# EAGLE design Teensy-Maxuino-Slave-DRV4835 4x shield v3 (EAGLE 6.4)
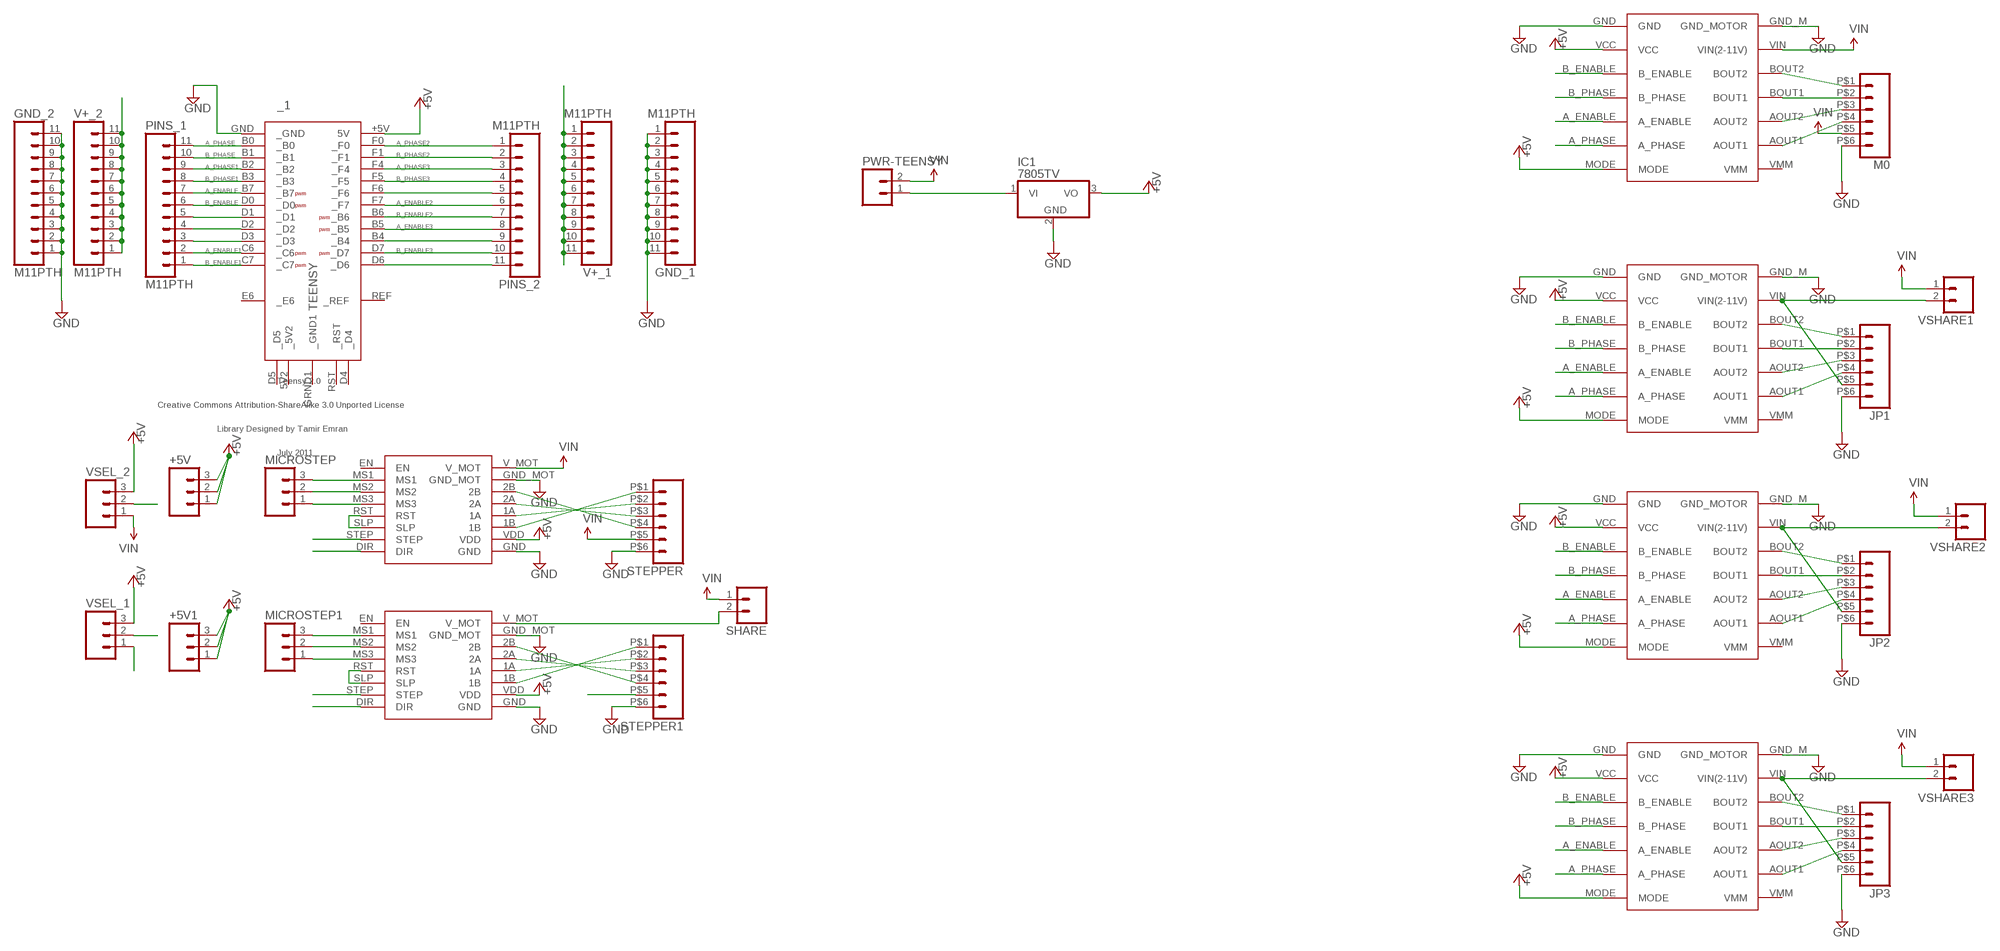
[diagram p0: schematic, sheet 1]

## Parts
+5V  M03PTH  [1X03]
+5V1  M03PTH  [1X03]
_1  TEENSY  [TEENSY]
A4988_1  POLOLU_A4988  [POLOLU_A4988]
A4988_2  POLOLU_A4988  [POLOLU_A4988]
DRV0  POLOLU_DRV8835  [POLOLU_DRV8835]
DRV1  POLOLU_DRV8835  [POLOLU_DRV8835]
DRV2  POLOLU_DRV8835  [POLOLU_DRV8835]
DRV3  POLOLU_DRV8835  [POLOLU_DRV8835]
GND_1  M11PTH  [1X11]
GND_2  M11PTH  [1X11]
IC1  7805TV  [TO220V]
JP1  M06  [SPRINGTERMINAL-2.54MM-6]
JP2  M06  [SPRINGTERMINAL-2.54MM-6]
JP3  M06  [SPRINGTERMINAL-2.54MM-6]
M0  M06  [SPRINGTERMINAL-2.54MM-6]
MICROSTEP  M03PTH  [1X03]
MICROSTEP1  M03PTH  [1X03]
PINS_1  M11PTH  [1X11]
PINS_2  M11PTH  [1X11]
PWR-TEENSY  M02PTH  [1X02]
SHARE  M02PTH  [1X02]
STEPPER  M06  [SPRINGTERMINAL-2.54MM-6]
STEPPER1  M06  [SPRINGTERMINAL-2.54MM-6]
V+_1  M11PTH  [1X11]
V+_2  M11PTH  [1X11]
VSEL_1  M03PTH  [1X03]
VSEL_2  M03PTH  [1X03]
VSHARE1  M02PTH  [1X02]
VSHARE2  M02PTH  [1X02]
VSHARE3  M02PTH  [1X02]

## Nets
+5V: +5V1.1 +5V1.2 +5V1.3 +5V.1 +5V.2 +5V.3 _1.+5V(5V) A4988_1.VDD A4988_2.VDD DRV0.MODE DRV0.VCC DRV1.MODE DRV1.VCC DRV2.MODE DRV2.VCC DRV3.MODE DRV3.VCC IC1.3(VO) VSEL_1.3 VSEL_2.3
A_ENABLE: _1.B7(_B7) DRV0.A_ENABLE PINS_1.7
A_ENABLE1: _1.C6(_C6) DRV1.A_ENABLE PINS_1.2
A_ENABLE2: _1.F7(_F7) DRV2.A_ENABLE PINS_2.6
A_ENABLE3: _1.B5(_B5) DRV3.A_ENABLE PINS_2.8
A_PHASE: _1.B0(_B0) DRV0.A_PHASE PINS_1.11
A_PHASE1: _1.B2(_B2) DRV1.A_PHASE PINS_1.9
A_PHASE2: _1.F0(_F0) DRV2.A_PHASE PINS_2.1
A_PHASE3: _1.F4(_F4) DRV3.A_PHASE PINS_2.3
ATTRU [GND]: JP1.P$6 JP2.P$6 JP3.P$6 M0.P$6 ; supply symbol labelled GND
B_ENABLE: _1.D0(_D0) DRV0.B_ENABLE PINS_1.6
B_ENABLE1: _1.C7(_C7) DRV1.B_ENABLE PINS_1.1
B_ENABLE2: _1.B6(_B6) DRV2.B_ENABLE PINS_2.7
B_ENABLE3: _1.D7(_D7) DRV3.B_ENABLE PINS_2.10
B_PHASE: _1.B1(_B1) DRV0.B_PHASE PINS_1.10
B_PHASE1: _1.B3(_B3) _1.D2(_D2) DRV1.B_PHASE PINS_1.4 PINS_1.8
B_PHASE2: _1.F1(_F1) DRV2.B_PHASE PINS_2.2
B_PHASE3: _1.F5(_F5) DRV3.B_PHASE PINS_2.4
DIR: _1.D6(_D6) A4988_1.DIR PINS_2.11
DIR1: _1.D1(_D1) A4988_2.DIR PINS_1.5
GND [GND]: _1.GND(_GND) A4988_1.GND A4988_1.GND_MOT A4988_2.GND A4988_2.GND_MOT DRV0.GND DRV0.GND_M(GND_MOTOR) DRV1.GND DRV1.GND_M(GND_MOTOR) DRV2.GND DRV2.GND_M(GND_MOTOR) DRV3.GND DRV3.GND_M(GND_MOTOR) GND_1.1 GND_1.2 GND_1.3 GND_1.4 GND_1.5 GND_1.6 GND_1.7 GND_1.8 GND_1.9 GND_1.10 GND_1.11 GND_2.1 GND_2.2 GND_2.3 GND_2.4 GND_2.5 GND_2.6 GND_2.7 GND_2.8 GND_2.9 GND_2.10 GND_2.11 IC1.2(GND) STEPPER1.P$6 STEPPER.P$6
N$1 [Power]: A4988_1.2B STEPPER.P$4
N$2 [Power]: A4988_1.2A STEPPER.P$3
N$3 [Power]: A4988_1.1A STEPPER.P$2
N$4 [Power]: A4988_1.1B STEPPER.P$1
N$5: A4988_2.RST A4988_2.SLP
N$6: A4988_1.RST A4988_1.SLP
N$7: A4988_2.MS1 MICROSTEP1.3
N$8: A4988_1.MS1 MICROSTEP.3
N$9: A4988_1.MS2 MICROSTEP.2
N$10: A4988_1.MS3 MICROSTEP.1
N$11: A4988_2.MS2 MICROSTEP1.2
N$12: A4988_2.MS3 MICROSTEP1.1
N$13: A4988_2.2B STEPPER1.P$4
N$14 [Power]: A4988_2.2A STEPPER1.P$3
N$15 [Power]: A4988_2.1A STEPPER1.P$2
N$16 [Power]: A4988_2.1B STEPPER1.P$1
N$21: _1.D3(_D3) PINS_1.3
N$28: _1.F6(_F6) PINS_2.5
N$35 [Power]: DRV0.AOUT1 M0.P$4
N$36 [Power]: DRV0.AOUT2 M0.P$3
N$37 [Power]: DRV0.BOUT1 M0.P$2
N$38 [Power]: DRV0.BOUT2 M0.P$1
N$39 [Power]: DRV1.AOUT1 JP1.P$4
N$40 [Power]: DRV1.AOUT2 JP1.P$3
N$41 [Power]: DRV1.BOUT1 JP1.P$2
N$42 [Power]: DRV1.BOUT2 JP1.P$1
N$43 [Power]: DRV2.AOUT1 JP2.P$4
N$44 [Power]: DRV2.AOUT2 JP2.P$3
N$45 [Power]: DRV2.BOUT1 JP2.P$2
N$46 [Power]: DRV2.BOUT2 JP2.P$1
N$47 [Power]: DRV3.AOUT1 JP3.P$4
N$48 [Power]: DRV3.AOUT2 JP3.P$3
N$49 [Power]: DRV3.BOUT1 JP3.P$2
N$50 [Power]: DRV3.BOUT2 JP3.P$1
N$51 [Power]: IC1.1(VI) PWR-TEENSY.1
STEP: _1.B4(_B4) A4988_1.STEP PINS_2.9
STEP1: A4988_2.STEP
V+_1: V+_1.1 V+_1.2 V+_1.3 V+_1.4 V+_1.5 V+_1.6 V+_1.7 V+_1.8 V+_1.9 V+_1.10 V+_1.11 VSEL_1.2
V+_2: V+_2.1 V+_2.2 V+_2.3 V+_2.4 V+_2.5 V+_2.6 V+_2.7 V+_2.8 V+_2.9 V+_2.10 V+_2.11 VSEL_2.2
VIN [Power]: A4988_1.V_MOT DRV0.VIN(VIN(2-11V)) M0.P$5 PWR-TEENSY.2 SHARE.1 STEPPER.P$5 VSEL_2.1 VSHARE1.1 VSHARE2.1 VSHARE3.1
VIN1 [Power]: DRV1.VIN(VIN(2-11V)) JP1.P$5 VSHARE1.2
VIN2 [Power]: DRV2.VIN(VIN(2-11V)) JP2.P$5 VSHARE2.2
VIN3 [Power]: DRV3.VIN(VIN(2-11V)) JP3.P$5 VSHARE3.2
VIN_2 [Power]: A4988_2.V_MOT SHARE.2 STEPPER1.P$5 VSEL_1.1
Unconnected: _1.5V2(_5V2) _1.D4(_D4) _1.D5(_D5) _1.E6(_E6) _1.GRND1(_GND1) _1.REF(_REF) _1.RST(_RST) A4988_1.EN A4988_2.EN DRV0.VMM DRV1.VMM DRV2.VMM DRV3.VMM

## Notes on the sheet
- A_PHASE | A_PHASE2
- B_PHASE | B_PHASE2
- A_PHASE1 | A_PHASE3
- B_PHASE1 | B_PHASE3
- A_ENABLE
- B_ENABLE | A_ENABLE2
- B_ENABLE2
- A_ENABLE3
- A_ENABLE1 | B_ENABLE3
- B_ENABLE1

## Library data of the parts
+5V +5V1 MICROSTEP MICROSTEP1 VSEL_1 VSEL_2 = SparkFun-Connectors:M03: Header 3 Standard 3-pin 0.1" header. Use with straight break away headers (SKU : PRT-00116), right angle break away headers (PRT-00553), swiss pins (PRT-00743), machine pins (PRT-00117), and female headers (PRT-00115). Molex polarized connector foot print use with SKU : PRT-08232 with associated crimp pins and housings.
_1 = aliEagleLib:TEENSY: Teensy 2.0 Original Design by Clint Fisher Modified Design by Tamir Emran Licensed Under Creative Commons Attribution-ShareAlike 3.0 Unported (CC BY-SA 3.0)
A4988_1 A4988_2 = aliEagleLib:POLOLU_A4988
DRV0 DRV1-DRV3 = aliEagleLib:POLOLU_DRV8835
GND_1 GND_2 PINS_1 PINS_2 V+_1 V+_2 = SparkFun-Connectors:M11: Header 11 Standard 11-pin 0.1" header. Use with straight break away headers (SKU : PRT-00116), right angle break away headers (PRT-00553), swiss pins (PRT-00743), machine pins (PRT-00117), and female headers (PRT-00115).
IC1 = linear:78*: Positive VOLTAGE REGULATOR Source: http://cache.national.com/ds/LM/LM78L05.pdf http://www.fairchildsemi.com/ds/LM/LM7805.pdf
JP1-JP3 M0 STEPPER STEPPER1 = aliEagleLib:M06: Header 6 Standard 6-pin 0.1" header. Use with straight break away headers (SKU : PRT-00116), right angle break away headers (PRT-00553), swiss pins (PRT-00743), machine pins (PRT-00117), and female headers (PRT-00115). Molex polarized connector foot print use with SKU : PRT-08094 with associated crimp pins and housings. NOTES ON THE VARIANTS LOCK and LOCK_LONGPADS... This footprint was designed to help hold the alignment of a through-hole component (i.e. 6-pin header) while soldering it into place. You may notice that each hole has been shifted either up or down by 0.005 of an inch from it's more standard position (which is a perfectly straight line). This slight alteration caused the pins (the squares in the middle) to touch the edges of the holes. Because they are alternating, it causes a "brace" to hold the component in place. 0.005 has proven to be the perfect amount of "off-center" position when using our standard breakaway headers. Although looks a little odd when you look at the bare footprint, once you have a header in there, the alteration is very hard to notice. Also, if you push a header all the way into place, it is covered up entirely on the bottom side. This idea of altering the position of holes to aid alignment will be further integrated into the Sparkfun Library for other footprints. It can help hold any component with 3 or more connection pins.
PWR-TEENSY VSHARE1-VSHARE3 = aliEagleLib:M02: Header 2 Standard 2-pin 0.1" header. Use with straight break away headers (SKU : PRT-00116), right angle break away headers (PRT-00553), swiss pins (PRT-00743), machine pins (PRT-00117), and female headers (PRT-00115). Molex polarized connector foot print use with SKU : PRT-08233 with associated crimp pins and housings.
SHARE = SparkFun-Connectors:M02: Header 2 Standard 2-pin 0.1" header. Use with straight break away headers (SKU : PRT-00116), right angle break away headers (PRT-00553), swiss pins (PRT-00743), machine pins (PRT-00117), and female headers (PRT-00115). Molex polarized connector foot print use with SKU : PRT-08233 with associated crimp pins and housings.

## Net classes
0 default: width 0.152 mm, clearance 0.152 mm
1 GND: width 0.508 mm, clearance 0.152 mm
2 Power: width 0.508 mm, clearance 0.152 mm

## Board
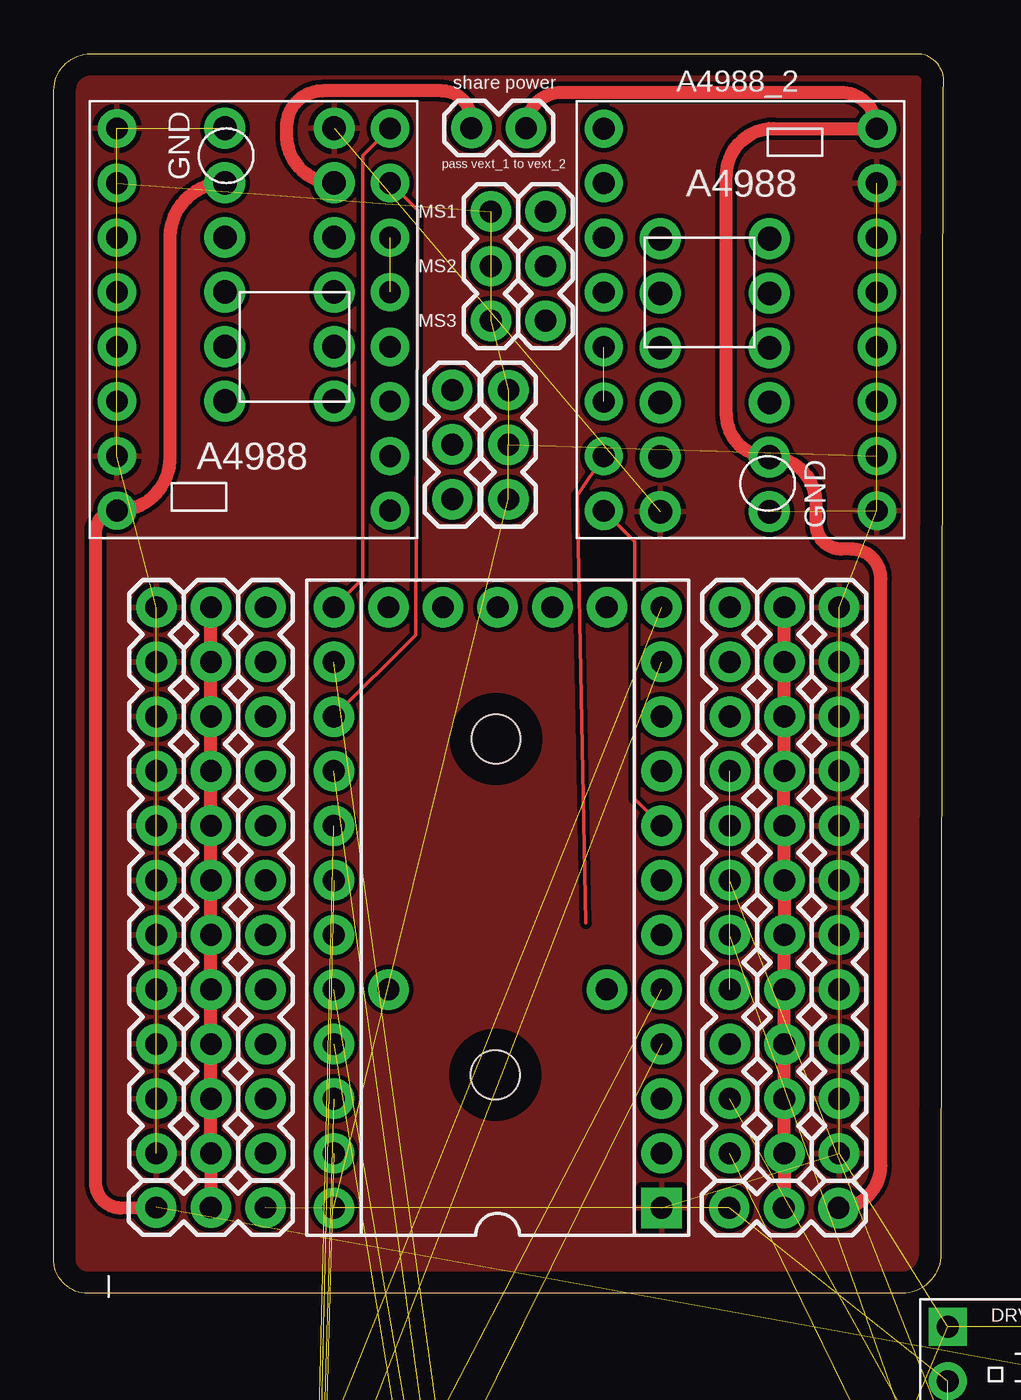
[diagram p1: board, top side]
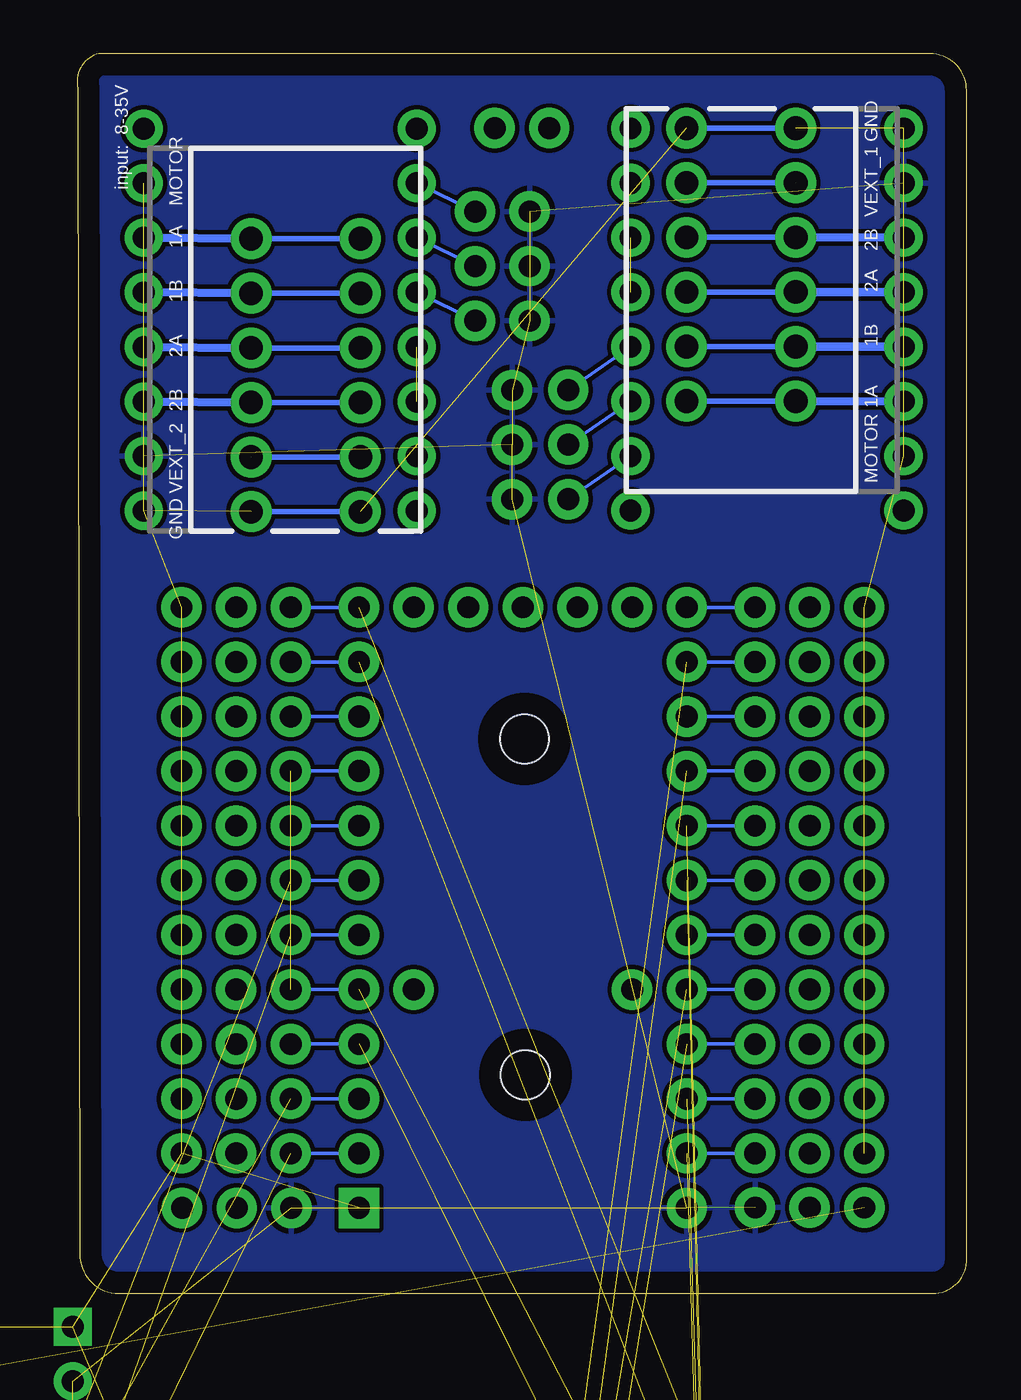
[diagram p2: board, bottom side, seen from below]

Size 41.38 x 57.68 mm. Coordinates in mm from the lower left corner, seen from the top.
Outline: 0.01,1.76 0.01,55.97 arc-90 1.72,57.68 40.36,57.68 arc-90 41.34,56.07 41.26,1.85 arc-90 39.45,0 1.44,0 arc-90 0.01,1.76
Copper layers (1*16): Top 0.035mm / dielectric 1.5mm / Bottom 0.035mm
Design rules "default *": minimum track width 6mil, minimum drill 24mil, track to track 8mil, track to pad 8mil, pad to pad 8mil, via to via 8mil, smd to smd 8mil, copper to edge 40mil, drill to drill 6mil, minimum pad ring 10mil, minimum via ring 8mil, stop-mask expansion 4mil, vias tented up to drill 0mil, thermal gap 10mil
Holes 2.26 mm at 20.53,10.17 20.57,25.8

### Footprints (pad centres in the part's own frame; a part is rotated, then mirrored left to right if it is on the bottom)
1X03 = drill 1.016 pad 1.88: 1 0,0; 2 2.54,0; 3 5.08,0
TEENSY = drill 1.016 pad 1.88: 5V2 13.97,-2.54; +5V -13.97,7.62; B0 -11.43,-7.62; B1 -8.89,-7.62; B2 -6.35,-7.62; B3 -3.81,-7.62; B4 8.89,7.62; B5 6.35,7.62; B6 3.81,7.62; B7 -1.27,-7.62; C6 11.43,-7.62; C7 13.97,-7.62; D0 1.27,-7.62; D1 3.81,-7.62; D2 6.35,-7.62; D3 8.89,-7.62; D4 13.97,5.08; D5 13.97,-5.08; D6 13.97,7.62; D7 11.43,7.62; E6 -3.81,-5.08; F0 -11.43,7.62; F1 -8.89,7.62; F4 -6.35,7.62; F5 -3.81,7.62; F6 -1.27,7.62; F7 1.27,7.62; GRND1 13.97,0; REF -3.81,5.08; RST 13.97,2.54 | drill 1.016 pad 1.88 square: GND -13.97,-7.62
POLOLU_A4988 = drill 1.016 pad 1.778: 1A 6.35,-1.27; 1B 6.35,-3.81; 2A 6.35,1.27; 2B 6.35,3.81; DIR -6.35,-8.89; EN -6.35,8.89; GND 6.35,-8.89; GND_MOT 6.35,6.35; MS1 -6.35,6.35; MS2 -6.35,3.81; MS3 -6.35,1.27; RST -6.35,-1.27; SLP -6.35,-3.81; STEP -6.35,-6.35; V_MOT 6.35,8.89; VDD 6.35,-6.35
POLOLU_DRV8835 = drill 1.016 pad 1.778: A_ENABLE -3.81,-3.81; A_PHASE -3.81,-6.35; AOUT1 3.81,-6.35; AOUT2 3.81,-3.81; B_ENABLE -3.81,1.27; B_PHASE -3.81,-1.27; BOUT1 3.81,-1.27; BOUT2 3.81,1.27; MODE -3.81,-8.89; VCC -3.81,3.81; VIN 3.81,3.81; VMM 3.81,-8.89 | drill 1.016 pad 1.778 square: GND -3.81,6.35; GND_M 3.81,6.35
1X11 = drill 1.016 pad 1.88: 1 0,0; 2 2.54,0; 3 5.08,0; 4 7.62,0; 5 10.16,0; 6 12.7,0; 7 15.24,0; 8 17.78,0; 9 20.32,0; 10 22.86,0; 11 25.4,0
TO220V = drill 1.016 long: 1 -2.54,-2.54; 2 0,-2.54; 3 2.54,-2.54
SPRINGTERMINAL-2.54MM-6 = drill 1.1 pad 1.9: 1 2.54,-2.54; 2 0,-2.54; 3 -2.54,-2.54; 4 -5.08,-2.54; 5 5.08,-2.54; 6 7.62,-2.54; P$1 2.54,2.54; P$2 0,2.54; P$3 -2.54,2.54; P$4 -5.08,2.54; P$5 5.08,2.54; P$6 7.62,2.54
1X02 = drill 1.016 pad 1.88: 1 0,0; 2 2.54,0

### Placement (x,y rotation side)
+5V  21.15,36.95 90 top
+5V1  20.33,45.26 90 top
_1  20.65,17.95 90 top
A4988_1  9.29,45.31 180 top
A4988_2  31.93,45.3 0 top
DRV0  45.38,-7.89 0 top
DRV1  5.14,-36.42 0 top  (outside the outline)
DRV2  15.43,-36.42 0 top  (outside the outline)
DRV3  25.72,-36.42 0 top  (outside the outline)
GND_1  36.52,31.92 270 top
GND_2  4.77,31.92 270 top
IC1  5.59,-60.51 0 top  (outside the outline)
JP1  40.27,-34.2 0 top  (outside the outline)
JP2  9.41,-52.11 0 top  (outside the outline)
JP3  27.49,-52.11 0 top  (outside the outline)
M0  45.56,-52.11 0 top  (outside the outline)
MICROSTEP  18.53,42.04 270 top
MICROSTEP1  22.87,45.26 90 top
PINS_1  31.44,31.92 270 top
PINS_2  9.85,6.52 90 top
PWR-TEENSY  12.78,-63.02 0 top  (outside the outline)
SHARE  19.42,54.22 0 top
STEPPER  10.5,46.59 90 bottom
STEPPER1  30.74,43.99 270 bottom
V+_1  33.98,31.92 270 top
V+_2  7.31,31.92 270 top
VSEL_1  36.49,3.98 180 top
VSEL_2  4.77,4 0 top
VSHARE1  25.85,-63.02 0 top  (outside the outline)
VSHARE2  35.28,-63.02 0 top  (outside the outline)
VSHARE3  44.7,-63.02 0 top  (outside the outline)

### Tracks (layer width: path | path; a pad name or v marks a point on that pad's centre or on a via)
+5V  (19 unrouted)
  pour Bottom: 40.97,57.71 40.97,0.49 0.96,0.49 0.96,57.39
A_ENABLE  (1 unrouted)
  Bottom 0.152: _1.B7 PINS_1.7
A_ENABLE1  (1 unrouted)
  Bottom 0.152: _1.C6 PINS_1.2
A_ENABLE2  (1 unrouted)
  Bottom 0.152: _1.F7 PINS_2.6
A_ENABLE3  (1 unrouted)
  Bottom 0.152: _1.B5 PINS_2.8
A_PHASE  (1 unrouted)
  Bottom 0.152: PINS_1.11 _1.B0
A_PHASE1  (1 unrouted)
  Bottom 0.152: PINS_1.9 _1.B2
A_PHASE2  (1 unrouted)
  Bottom 0.152: PINS_2.1 _1.F0
A_PHASE3  (1 unrouted)
  Bottom 0.152: PINS_2.3 _1.F4
ATTRU  (3 unrouted)
B_ENABLE  (1 unrouted)
  Bottom 0.152: PINS_1.6 _1.D0
B_ENABLE1  (1 unrouted)
  Bottom 0.152: _1.C7 PINS_1.1
B_ENABLE2  (1 unrouted)
  Bottom 0.152: PINS_2.7 _1.B6
B_ENABLE3  (1 unrouted)
  Bottom 0.152: PINS_2.10 _1.D7
B_PHASE  (1 unrouted)
  Bottom 0.152: _1.B1 PINS_1.10
B_PHASE1  (2 unrouted)
  Bottom 0.152: _1.D2 PINS_1.4 | PINS_1.8 _1.B3
B_PHASE2  (1 unrouted)
  Bottom 0.152: _1.F1 PINS_2.2
B_PHASE3  (1 unrouted)
  Bottom 0.152: _1.F5 PINS_2.4
DIR
  Top 0.152: _1.D6 14.36,33.26 14.36,52.93 A4988_1.DIR
  Bottom 0.152: _1.D6 PINS_2.11
DIR1
  Top 0.152: _1.D1 27.01,23.01 27.01,34.98 A4988_2.DIR
  Bottom 0.152: PINS_1.5 _1.D1
GND  (37 unrouted)
  pour Top: 0.35,2.81 arc90 1.8,0.44 39.42,0.44 arc90 40.86,1.99 41.15,56.29 arc90 39.91,57.22 0.41,57.25
N$1
  Bottom 0.406: 7.96,41.51 A4988_1.2B
N$2
  Bottom 0.406: 7.96,44.05 A4988_1.2A
N$3
  Bottom 0.406: 7.96,46.59 A4988_1.1A
N$4
  Bottom 0.406: 7.96,49.13 A4988_1.1B
N$5  (1 unrouted)
N$6  (1 unrouted)
N$7
  Bottom 0.152: MICROSTEP1.3 A4988_2.MS1
N$8
  Bottom 0.152: MICROSTEP.3 A4988_1.MS1
N$9
  Bottom 0.152: A4988_1.MS2 MICROSTEP.2
N$10
  Bottom 0.152: MICROSTEP.1 A4988_1.MS3
N$11
  Bottom 0.152: A4988_2.MS2 MICROSTEP1.2
N$12
  Bottom 0.152: MICROSTEP1.1 A4988_2.MS3
N$13
  Bottom 0.406: 33.28,49.07 A4988_2.2B
N$14
  Bottom 0.406: 33.28,46.53 A4988_2.2A
N$15
  Bottom 0.406: 33.28,43.99 A4988_2.1A
N$16
  Bottom 0.406: 33.28,41.45 A4988_2.1B
N$21
  Bottom 0.152: PINS_1.3 _1.D3
N$28
  Bottom 0.152: PINS_2.5 _1.F6
N$35  (1 unrouted)
N$36  (1 unrouted)
N$37  (1 unrouted)
N$38  (1 unrouted)
N$39  (1 unrouted)
N$40  (1 unrouted)
N$41  (1 unrouted)
N$42  (1 unrouted)
N$43  (1 unrouted)
N$44  (1 unrouted)
N$45  (1 unrouted)
N$46  (1 unrouted)
N$47  (1 unrouted)
N$48  (1 unrouted)
N$49  (1 unrouted)
N$50  (1 unrouted)
N$51  (1 unrouted)
STEP
  Top 0.152: _1.B4 16.83,30.62 16.92,50.39 A4988_1.STEP
  Bottom 0.152: _1.B4 PINS_2.9
STEP1
  Top 0.152: 24.75,17.24 24.34,37.13 A4988_2.STEP
V+_1
  Top 0.61: V+_1.1 V+_1.2 V+_1.3 V+_1.4 33.93,21.81 V+_1.5 V+_1.6 V+_1.7 V+_1.8 V+_1.9 V+_1.10 V+_1.11 33.98,4.01 arc-90 VSEL_1.2
V+_2
  Top 0.61: V+_2.1 V+_2.2 V+_2.3 V+_2.4 V+_2.5 V+_2.6 V+_2.7 V+_2.8 V+_2.9 V+_2.10 V+_2.11 VSEL_2.2 arc90 VSEL_2.2
VIN  (7 unrouted)
  Top 0.61: VSEL_2.1 3.13,3.98 arc-90 1.93,5.18 1.93,35.42 arc-90 A4988_1.V_MOT arc90 5.41,38.9 5.41,49.13 arc-90 7.96,51.67 | SHARE.1 19.42,54.57 arc90 18.04,55.95 12.5,55.95 arc90 10.82,54.27 10.82,53.89 arc90 STEPPER.P$5
VIN1  (2 unrouted)
VIN2  (2 unrouted)
VIN3  (2 unrouted)
VIN_2  (1 unrouted)
  Top 0.61: SHARE.2 arc-90 23.63,55.88 36.59,55.88 arc-90 A4988_2.V_MOT arc90 A4988_2.V_MOT 33.47,54.2 arc90 31.28,52.02 31.28,40.91 arc90 33.28,38.91 arc-90 35.45,36.74 35.45,35.8 arc90 36.62,34.63 37.09,34.63 arc-90 38.46,33.26 38.46,5.95 arc-90 VSEL_1.1